# Altium schematic sheet [08] - TEMP CONTROL.SchDoc: TEMP CONTROL
size 433 x 279 mm; Author: ZAG; DrawnBy: ZAG; DocumentNumber: 5; SheetNumber: 8; SheetTotal: 8; PageSetup: Record=PageOptions|CenterHorizontal=True|CenterVertical=True|PrintScale=0.96|XCorrection=1.00|YCorrection=1.00|PrintKind=2|BorderSize=5000000|LeftOffset=0|BottomOffset=0|Orientation=2|PaperLength=4318|PaperWidth=2794|Scale=100|PaperSource=15|PrintQuality=600|MediaType=1|DitherType=10|PaperKind=11x17|PrintScaleMode=1; PCBRevision: 01; SchRevision: 01; Project: VAN BATT CTRLR V1; SchStatus: PRELIM
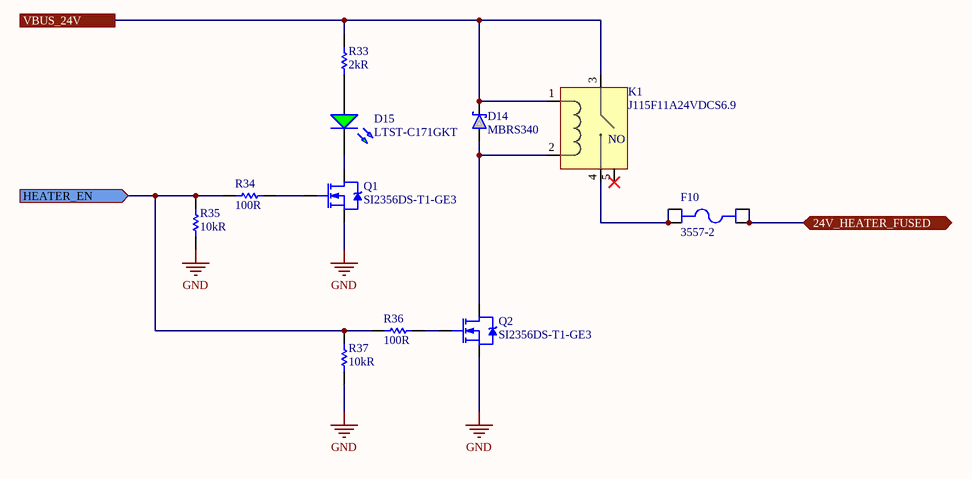
[diagram p0: [08] - TEMP CONTROL.SchDoc]

## Parts
D14  MBRS340  [D0-214AB SMC - L]
D15  LTST-C171GKT  [LED - 0805 - GREEN]
F10  3557-2  [KEYSTONE_3557-2]
K1  J115F11A24VDCS6.9  [CIT_J115F11A24VDCS6_9]
Q1  SI2356DS-T1-GE3  [SOT23-3P95_237X112L50X42N]
Q2  SI2356DS-T1-GE3  [SOT23-3P95_237X112L50X42N]
R33  2kR  [INCH 0805 - METRIC 2012 - H065]
R34  100R  [INCH 0603 - METRIC 1608 - H055]
R35  10kR  [INCH 0603 - METRIC 1508 - H050]
R36  100R  [INCH 0603 - METRIC 1608 - H055]
R37  10kR  [INCH 0603 - METRIC 1508 - H050]

## Ports
24V_HEATER_FUSED (bidir), HEATER_EN (in), VBUS_24V

## Nets
GND: Q1.2(S) Q2.2(S) R35.2 R37.2
24V_HEATER_FUSED: F10.3 F10.4 ; port 24V_HEATER_FUSED
HEATER_EN: R34.1 R35.1 R36.1 R37.1 ; port HEATER_EN
VBUS_24V: D14.1 K1.1 K1.3 R33.1 ; port VBUS_24V
NetD14_2: D14.2 K1.2 Q2.3(D)
NetD15_A: D15.A R33.2
NetD15_C: D15.C Q1.3(D)
NetF10_1: F10.1 F10.2 K1.4
NetQ1_1: Q1.1(G) R34.2
NetQ2_1: Q2.1(G) R36.2

Not connected (* = marked no-connect by the designer): K1 5*

## Notes on the sheet
- SHEET TITLE
- SCH REV:
- PROJECT NAME
- PCB REV:
- DATE:
- DRAWN BY
- CONTACT
- MANUFACTURER, OR SALE OF PROCESSES OR PRODUCTS WITHOUT THE EXPRESSED WRITTEN CONSENT OF
- THE INFORMATION CONTAINED HEREIN IS DEEMED TO BE CONFIDENTIAL, PROPRIETARY, AND A TRADE SECRET OF
- THIS INFORMATION MAY NOT BE USED, REPRODUCED, OR DISCLOSED AS THE DIRECT OR INDIRECT BASIS FOR THE DEVELOPMENT,
- SHEET
- www.mule-labs.com <http://www.mule-labs.com>
- OF
- SIZE: B
- DO NOT SCALE DRAWING
- (in symbol J115F11A24VDCS6.9) NO

## Library data of the parts
D14 = MBRS340: DIODE SCHOTTKY 40V 4A SMC; Manufacturer: ON Semiconductor / Fairchild; Element Configuration: Single; Max Surge Current: 80A; Max Reverse Leakage Current: 2mA; Polarity: Standard; Current Rating: 3A; Forward Voltage: 525mV; Supplier 1: Digi-Key; Manufacturer Part Number: MBRS340; Stock 1: 32395; Pricing 1: 1=0.65, 10=0.554, 100=0.4137, 500=0.32502, 1000=0.25115 (USD); Mount: Surface Mount; Number of Pins: 2; Weight: 0.3g; Contact Plating: Tin,Matte; Min Operating Temperature: -65°C; Max Operating Temperature: 125°C; Packaging: Tape and Reel; Average Rectified Current: 4A; Max Reverse Voltage (DC): 40V; Package Quantity: 1; Peak Non-Repetitive Surge Current: 80A; Voltage Rating (DC): 40V; Output Current: 3A; Peak Reverse Current: 2mA; Max Repetitive Reverse Voltage (Vrrm): 40V; Forward Current: 4A; Max Forward Surge Current (Ifsm): 80A; Length: 7.15mm; Height: 2.75mm; Width: 6.25mm; Radiation Hardening: No; Lead Free: Lead Free; REACH SVHC: No SVHC; ComponentLink1URL: https://datasheet.ciiva.com/22651/48013-22651968.pdf; ComponentLink1Description: https://datasheet.ciiva.com/22651/48013-22651968.pdf; ComponentLink2URL: https://datasheet.ciiva.com/4714/mbrs340-63506-4714275.pdf; ComponentLink2Description: https://datasheet.ciiva.com/4714/mbrs340-63506-4714275.pdf; ComponentLink3URL: https://datasheet.ciiva.com/8303/mbrs340-8303605.pdf; ComponentLink3Description: https://datasheet.ciiva.com/8303/mbrs340-8303605.pdf; ComponentLink4URL: https://datasheet.ciiva.com/8303/mbrs340-8303610.pdf; ComponentLink4Description: https://datasheet.ciiva.com/8303/mbrs340-8303610.pdf; ComponentLink5URL: https://datasheet.ciiva.com/30479/0900766b810e2514-30479354.pdf; ComponentLink5Description: https://datasheet.ciiva.com/30479/0900766b810e2514-30479354.pdf; ComponentLink6URL: https://datasheet.ciiva.com/911/mbrs340-911131.pdf; ComponentLink6Description: https://datasheet.ciiva.com/911/mbrs340-911131.pdf; ComponentLink7URL: https://datasheet.ciiva.com/911/mbrs340-911132.pdf; ComponentLink7Description: https://datasheet.ciiva.com/911/mbrs340-911132.pdf; ComponentLink8URL: https://datasheet.ciiva.com/911/mbrs340-911133.pdf; ComponentLink8Description: https://datasheet.ciiva.com/911/mbrs340-911133.pdf; ComponentLink9URL: https://datasheet.ciiva.com/15144/getdatasheetpartid-102412-15144829.pdf; ComponentLink9Description: https://datasheet.ciiva.com/15144/getdatasheetpartid-102412-15144829.pdf; ComponentLink10URL: https://datasheet.ciiva.com/25951/mbrs340-25951711.pdf; ComponentLink10Description: https://datasheet.ciiva.com/25951/mbrs340-25951711.pdf; ComponentLink11URL: https://datasheet.ciiva.com/26788/mbrs340-26788710.pdf; ComponentLink11Description: https://datasheet.ciiva.com/26788/mbrs340-26788710.pdf; Supplier Part Number 1: MBRS340FSCT-ND; Category: Diode
D15 = LTST-C171GKT: Lite-On LTST-C171GKT, CHIPLED 0805 Series Green LED, 569 nm 2012 (0805), Rectangle Lens SMD package; Manufacturer: Vishay Lite-On; Lens Colour: Clear,Colorless; Viewing Angle: 130°; Lens Style: Clear,Diffused,Colorless,Rectangular; Luminous Intensity: 12mcd; Forward Current: 30mA; Forward Voltage: 2.1V; Power Rating: 100mW; Dominant Wavelength: 569nm; Test Current: 10mA; Lens Transparency: Clear; Number of Elements: 1; Wavelength: 585nm; Reverse Voltage: 5V; Supplier 1: Digi-Key; Manufacturer Part Number: LTST-C171GKT; Stock 1: 271428; Pricing 1: 1=0.29, 10=0.211, 25=0.1556, 100=0.1111, 250=0.07556, 500=0.06666, 1000=0.05222 (USD); Mount: Surface Mount; Case/Package: 0805; Number of Pins: 2; Color: Green; Case Code (Metric): 2012; Case Code (Imperial): 0805; Min Operating Temperature: -55°C; Max Operating Temperature: 85°C; Package Quantity: 1; Packaging: Tape and Reel; Illumination Colour: Green; Power Dissipation: 100mW; Number of LEDs: 1; Length: 2mm; Height: 0.8mm; Width: 1.25mm; Depth: 1.25mm; Radiation Hardening: No; Lead Free: Lead Free; ComponentLink1URL: https://datasheet.ciiva.com/2110/ltst-c171gkt-2110000.pdf; ComponentLink1Description: https://datasheet.ciiva.com/2110/ltst-c171gkt-2110000.pdf; ComponentLink2URL: https://datasheet.ciiva.com/2110/ltst-c171gkt-2110001.pdf; ComponentLink2Description: https://datasheet.ciiva.com/2110/ltst-c171gkt-2110001.pdf; ComponentLink3URL: https://datasheet.ciiva.com/2110/ltst-c171gkt-2110002.pdf; ComponentLink3Description: https://datasheet.ciiva.com/2110/ltst-c171gkt-2110002.pdf; ComponentLink4URL: https://datasheet.ciiva.com/16396/ltst-c171gkt-16396549.pdf; ComponentLink4Description: https://datasheet.ciiva.com/16396/ltst-c171gkt-16396549.pdf; ComponentLink5URL: https://datasheet.ciiva.com/11773/0900766b80dc0296-11773991.pdf; ComponentLink5Description: https://datasheet.ciiva.com/11773/0900766b80dc0296-11773991.pdf; ComponentLink6URL: https://datasheet.ciiva.com/12400/lite-on-ltst-c171gkt-190133-12400647.pdf; ComponentLink6Description: https://datasheet.ciiva.com/12400/lite-on-ltst-c171gkt-190133-12400647.pdf; Supplier Part Number 1: 160-1423-1-ND; Category: LED
F10 = 3557-2: Fuse Holder; Auto; 2 in1 Blade; THM; 1 Fuse; Vertical; 30 Amps; Manufacturer: Keystone Electronics; Color: Black; Material: Brass,Tin,Nylon; Current Rating: 20A; Voltage Rating (AC): 500V; Number of Poles: 1; Illumination Type: Illuminated; Fuse Type: Automotive; Fuse Size: ATO, ATC, or Mini ATO, ATC; Supplier 1: Digi-Key; Manufacturer Part Number: 3557-2; RoHS: Yes; Category: Fuses; Pricing 1: 1=1.22000, 25=1.01080, 100=0.92640, 250=0.84220, 500=0.75798, 1000=0.67376, 2500=0.61060, 5000=0.58954 (USD); Mount: Vertical,PCB; Contact Plating: Tin; Contact Material: Brass; Min Operating Temperature: -50°C; Max Operating Temperature: 145°C; Package Quantity: 1; Number of Circuits: 1; Termination: PC Pin; Voltage: 500V; Fuse Current: 20A; Orientation: Vertical; Series: -; Length: 19.8mm; Depth: 6.8mm; Size: 0.265inch; REACH SVHC: No SVHC; Lead Free: Lead Free; Flammability Rating: UL94 V-0; ComponentLink1URL: https://datasheet.ciiva.com/22650/1686040-22650698.pdf?src-supplier=Element14; ComponentLink1Description: https://datasheet.ciiva.com/22650/1686040-22650698.pdf?src-supplier=Element14; ComponentLink2URL: https://datasheet.ciiva.com/16369/m60-2p39-16369546.pdf?src-supplier=Future+Electronics; ComponentLink2Description: https://datasheet.ciiva.com/16369/m60-2p39-16369546.pdf?src-supplier=Future+Electronics; Supplier Part Number 1: 36-3557-2-ND
K1 = J115F11A24VDCS6.9: Manufacturer: CIT Relay & Switch; Supplier 1: Digi-Key; Manufacturer Part Number: J115F11A24VDCS6.9; RoHS: No; Stock 1: 7830; Pricing 1: 1=2.82000, 15=2.64600, 30=2.35200, 45=2.23444, 90=2.11678, 240=1.88158, 450=1.76400, 945=1.64640 (USD); Supplier Part Number 1: 2449-J115F11A24VDCS6.9-ND
Q1 Q2 = SI2356DS-T1-GE3: Si2356DS Series 40 V 3.2 A 51 mOhm Surface Mount N-Channel Mosfet - SOT-23-3; Manufacturer: Vishay Siliconix; Rds On Max: 51mR; Input Capacitance: 370pF; Rise Time: 52ns; Drain to Source Voltage (Vdss): 40V; Continuous Drain Current (ID): 4.3A; Max Power Dissipation: 1.7W; Gate to Source Voltage (Vgs): 12V; Drain to Source Resistance: 56mR; Fall Time: 53ns; Turn-Off Delay Time: 18ns; Threshold Voltage: 1.5V; Element Configuration: Single; Number of Channels: 1; Turn-On Delay Time: 10ns; Supplier 1: Digi-Key; Manufacturer Part Number: SI2356DS-T1-GE3; RoHS: Yes; Category: MOSFETs; Stock 1: 50; Pricing 1: 1=0.42000, 10=0.34200, 100=0.23300, 500=0.17476, 1000=0.13108 (USD); Mount: Surface Mount; Case/Package: TO-236-3; Number of Pins: 3; Weight: 0.050717oz; Min Operating Temperature: -55°C; Max Operating Temperature: 150°C; Packaging: Tape and Reel; Package Quantity: 3000; Drain to Source Breakdown Voltage: 40V; REACH SVHC: No SVHC; Lead Free: Lead Free; RoHS Compliant: Yes; ComponentLink1URL: https://datasheet.ciiva.com/29755/si2356ds-29755664.pdf?src-supplier=Digi-Key; ComponentLink1Description: https://datasheet.ciiva.com/29755/si2356ds-29755664.pdf?src-supplier=Digi-Key; ComponentLink2URL: https://datasheet.ciiva.com/24111/si2356ds-268760-24111179.pdf?src-supplier=Mouser; ComponentLink2Description: https://datasheet.ciiva.com/24111/si2356ds-268760-24111179.pdf?src-supplier=Mouser; ComponentLink3URL: https://datasheet.ciiva.com/29755/si2356ds-29755653.pdf?src-supplier=Digi-Key; ComponentLink3Description: https://datasheet.ciiva.com/29755/si2356ds-29755653.pdf?src-supplier=Digi-Key; ComponentLink4URL: https://datasheet.ciiva.com/29755/si2356ds-29755658.pdf?src-supplier=Digi-Key; ComponentLink4Description: https://datasheet.ciiva.com/29755/si2356ds-29755658.pdf?src-supplier=Digi-Key; Supplier Part Number 1: SI2356DS-T1-GE3CT-ND
R33 = CRCW08052K00FKEA: Res Thick Film 0805 2K Ohm 1% 1/8W ±100ppm/°C Molded SMD Paper T/R; Manufacturer: Vishay; Number of Terminals/Pins: 2; Power Rating: 125mW; Voltage Rating: 150V; Supplier 1: Digi-Key; Manufacturer Part Number: CRCW08052K00FKEA; RoHS: Yes; Category: Chip SMD Resistors; Stock: 25162; Pricing: 1=0.10000, 10=0.06500, 100=0.02660, 1000=0.01195, 2500=0.01037 (USD); Mount: Surface Mount; Case/Package: 0805; Number of Pins: 2; Contact Plating: Tin; Weight: 0.000194oz; Case Code (Imperial): 0805; Case Code (Metric): 2012; Package Shape: Rectangular; Min Operating Temperature: -55°C; Max Operating Temperature: 155°C; Tolerance: 1%; Resistance: 2kR; Resistor Type: Thick Film; Temperature Coefficient: 100ppm/°C; Packaging: Tape and Reel; Package Quantity: 10; Termination: SMD/SMT; Number of Terminations: 2; Max Power Dissipation: 125mW; Features: Automotive AEC-Q200; Technology: THICK FILM; Voltage Rating (DC): 150V; Working Voltage: 150V; Length: 2mm; Width: 1.25mm; Height: 0.02inch; Depth: 1.25mm; Radiation Hardening: No; Lead Free: Lead Free; RoHS Compliant: Yes; Military Standard: Not; REACH SVHC: Unknown; ComponentLink1URL: https://datasheet.ciiva.com/9093/dcrcwe3-9093501.pdf?src-supplier=Avnet; ComponentLink1Description: https://datasheet.ciiva.com/9093/dcrcwe3-9093501.pdf?src-supplier=Avnet; ComponentLink2URL: https://datasheet.ciiva.com/2467/dcrcwe3-2467164.pdf?src-supplier=Digi-Key; ComponentLink2Description: https://datasheet.ciiva.com/2467/dcrcwe3-2467164.pdf?src-supplier=Digi-Key; ComponentLink3URL: https://datasheet.ciiva.com/2467/dcrcwe3-2467165.pdf?src-supplier=Digi-Key; ComponentLink3Description: https://datasheet.ciiva.com/2467/dcrcwe3-2467165.pdf?src-supplier=Digi-Key; ComponentLink4URL: https://datasheet.ciiva.com/2467/dcrcwe3-2467166.pdf?src-supplier=Digi-Key; ComponentLink4Description: https://datasheet.ciiva.com/2467/dcrcwe3-2467166.pdf?src-supplier=Digi-Key; ComponentLink5URL: https://datasheet.ciiva.com/5547/dcrcwe3-109170-5547611.pdf?src-supplier=Mouser; ComponentLink5Description: https://datasheet.ciiva.com/5547/dcrcwe3-109170-5547611.pdf?src-supplier=Mouser; ComponentLink6URL: https://datasheet.ciiva.com/16199/dcrcwe3-16199147.pdf?src-supplier=Future+Electronics; ComponentLink6Description: https://datasheet.ciiva.com/16199/dcrcwe3-16199147.pdf?src-supplier=Future+Electronics; ComponentLink7URL: https://datasheet.ciiva.com/15158/getdatasheetpartid-246953-15158870.pdf?src-supplier=Verical; ComponentLink7Description: https://datasheet.ciiva.com/15158/getdatasheetpartid-246953-15158870.pdf?src-supplier=Verical; ComponentLink8URL: https://datasheet.ciiva.com/7673/1720486-7673483.pdf?src-supplier=Element14; ComponentLink8Description: https://datasheet.ciiva.com/7673/1720486-7673483.pdf?src-supplier=Element14; ComponentLink9URL: https://datasheet.ciiva.com/17202/dcrcwe3-17202695.pdf?src-supplier=Avnet+Europe; ComponentLink9Description: https://datasheet.ciiva.com/17202/dcrcwe3-17202695.pdf?src-supplier=Avnet+Europe; ComponentLink10URL: https://datasheet.ciiva.com/16772/70201119-16772086.pdf?src-supplier=Allied+Electronics; ComponentLink10Description: https://datasheet.ciiva.com/16772/70201119-16772086.pdf?src-supplier=Allied+Electronics; ComponentLink11URL: https://datasheet.ciiva.com/7673/1697337-7673343.pdf?src-supplier=Element14; ComponentLink11Description: https://datasheet.ciiva.com/7673/1697337-7673343.pdf?src-supplier=Element14; ComponentLink12URL: https://datasheet.ciiva.com/7673/1720486-7673482.pdf?src-supplier=Element14; ComponentLink12Description: https://datasheet.ciiva.com/7673/1720486-7673482.pdf?src-supplier=Element14; Supplier Part Number 1: 541-2.00KCCT-ND
R34 R36 = CPF0603B100RE1: RES SMD 100 OHM 0.1% 1/16W 0603; Manufacturer: TE Connectivity Neohm; Temperature Coefficient: 25ppm/°C; Power Rating: 63mW; Voltage Rating: 50V; Number of Resistors: 1; Supplier 1: Digi-Key; Manufacturer Part Number: CPF0603B100RE1; RoHS: Yes; Category: Chip SMD Resistors; Stock: 7060; Pricing: 1=0.65000, 10=0.46300, 100=0.24080 (USD); Mount: Surface Mount; Case/Package: 0603; Number of Pins: 2; Weight: 7.1E-05oz; Case Code (Imperial): 0603; Case Code (Metric): 1608; Min Operating Temperature: -55°C; Max Operating Temperature: 155°C; Resistance: 100R; Tolerance: 0.1%; Packaging: Tape and Reel; Package Quantity: 1000; Composition: Thin Film; Number of Terminations: 2; Termination: Solder; Voltage Rating (DC): 50V; Length: 1.55mm; Height: 0.45mm; Width: 0.8mm; REACH SVHC: No SVHC; ELV: Compliant; ComponentLink1URL: https://datasheet.ciiva.com/6767/1652074-6767153.pdf?src-supplier=Newark; ComponentLink1Description: https://datasheet.ciiva.com/6767/1652074-6767153.pdf?src-supplier=Newark; ComponentLink2URL: https://datasheet.ciiva.com/6116/eng-ds-1773200-j-6116235.pdf?src-supplier=Farnell; ComponentLink2Description: https://datasheet.ciiva.com/6116/eng-ds-1773200-j-6116235.pdf?src-supplier=Farnell; ComponentLink3URL: https://datasheet.ciiva.com/12834/eng-ds-1773200-i-12834812.pdf?src-supplier=Mouser; ComponentLink3Description: https://datasheet.ciiva.com/12834/eng-ds-1773200-i-12834812.pdf?src-supplier=Mouser; Supplier Part Number 1: A102330CT-ND
R35 R37 = CRCW060310K0JNEA: RES SMD 10K OHM 5% 1/10W 0603; Manufacturer: Vishay Dale; Temperature Coefficient: 200ppm/°C; Max Power Dissipation: 100mW; Voltage Rating: 75V; Supplier 1: Digi-Key; Manufacturer Part Number: CRCW060310K0JNEA; RoHS: Yes; Category: Chip SMD Resistors; Stock 1: 5423; Pricing 1: 1=0.10000, 10=0.03100, 100=0.01250, 1000=0.00563, 2500=0.00488 (USD); Mount: Surface Mount; Case/Package: 0603; Number of Pins: 2; Case Code (Metric): 1608; Case Code (Imperial): 0603; Contact Plating: Tin; Weight: 7.1E-05oz; Size Code: 0603; Min Operating Temperature: -55°C; Max Operating Temperature: 155°C; Resistance: 10kR; Tolerance: 5%; Resistor Type: Thick Film; Packaging: Tape and Reel; Number of Terminations: 2; Package Quantity: 1; Power Rating: 100mW; Termination: SMD/SMT; Features: Automotive AEC-Q200; Voltage Rating (DC): 75V; Series: CRCW; Construction: Rectangular; Resistance Tolerance: 5%; Length: 1.55mm; Width: 0.033inch; Height: 0.02inch; Depth: 0.85mm; Radiation Hardening: No; Lead Free: Lead Free; RoHS Compliant: Yes; REACH SVHC: Unknown; Military Standard: Not; ComponentLink1URL: https://datasheet.ciiva.com/2461/dcrcwe3-2461971.pdf?src-supplier=Digi-Key; ComponentLink1Description: https://datasheet.ciiva.com/2461/dcrcwe3-2461971.pdf?src-supplier=Digi-Key; ComponentLink2URL: https://datasheet.ciiva.com/2461/dcrcwe3-2461972.pdf?src-supplier=Digi-Key; ComponentLink2Description: https://datasheet.ciiva.com/2461/dcrcwe3-2461972.pdf?src-supplier=Digi-Key; ComponentLink3URL: https://datasheet.ciiva.com/2461/dcrcwe3-2461973.pdf?src-supplier=Digi-Key; ComponentLink3Description: https://datasheet.ciiva.com/2461/dcrcwe3-2461973.pdf?src-supplier=Digi-Key; ComponentLink4URL: https://datasheet.ciiva.com/16343/dcrcwe3-16343525.pdf?src-supplier=Future+Electronics; ComponentLink4Description: https://datasheet.ciiva.com/16343/dcrcwe3-16343525.pdf?src-supplier=Future+Electronics; ComponentLink5URL: https://datasheet.ciiva.com/16755/70201119-16755717.pdf?src-supplier=Allied+Electronics; ComponentLink5Description: https://datasheet.ciiva.com/16755/70201119-16755717.pdf?src-supplier=Allied+Electronics; ComponentLink6URL: https://datasheet.ciiva.com/16771/70201119-16771051.pdf?src-supplier=Allied+Electronics; ComponentLink6Description: https://datasheet.ciiva.com/16771/70201119-16771051.pdf?src-supplier=Allied+Electronics; ComponentLink7URL: https://datasheet.ciiva.com/16515/dcrcwe3-16515020.pdf?src-supplier=Avnet+Asia; ComponentLink7Description: https://datasheet.ciiva.com/16515/dcrcwe3-16515020.pdf?src-supplier=Avnet+Asia; ComponentLink8URL: https://datasheet.ciiva.com/3256/dcrcwe3-3256942.pdf?src-supplier=Avnet; ComponentLink8Description: https://datasheet.ciiva.com/3256/dcrcwe3-3256942.pdf?src-supplier=Avnet; ComponentLink9URL: https://datasheet.ciiva.com/3256/dcrcwe3-3256943.pdf?src-supplier=Avnet; ComponentLink9Description: https://datasheet.ciiva.com/3256/dcrcwe3-3256943.pdf?src-supplier=Avnet; Supplier Part Number 1: 541-10KGCT-ND